# Altium schematic sheet Inversor.SchDoc
size A4
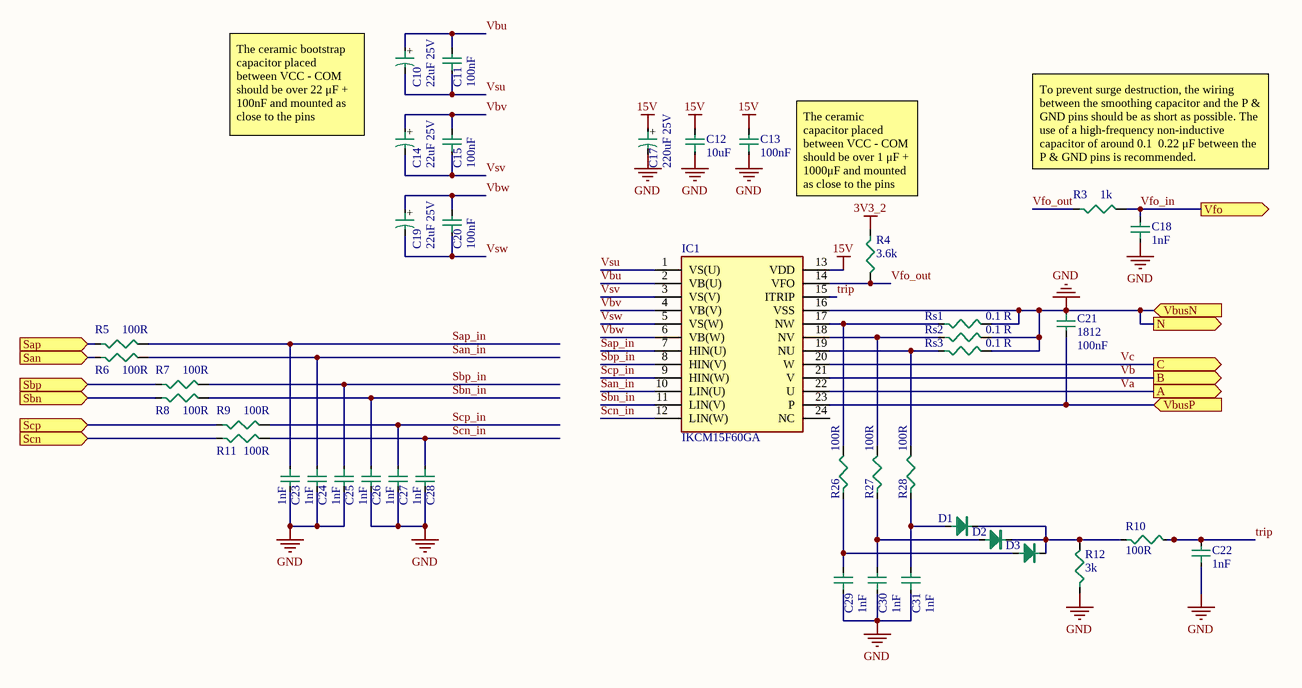
[diagram p0: Inversor.SchDoc]

## Parts
C10  value 22uF 25V  [CAP SMD D5.0 A5.4]  (hidden comment: D5.0 A5.4)
C11  value 100nF  [0805C]  (hidden comment: 0805)
C12  value 10uF  [0805C]  (hidden comment: 0805)
C13  value 100nF  [0805C]  (hidden comment: 0805)
C14  value 22uF 25V  [CAP SMD D5.0 A5.4]  (hidden comment: D5.0 A5.4)
C15  value 100nF  [0805C]  (hidden comment: 0805)
C17  value 220uF 25V  [CAP SMD D8.0 A10.2]  (hidden comment: D8.0 A10.2)
C18  value 1nF  [0805C]  (hidden comment: 0805)
C19  value 22uF 25V  [CAP SMD D5.0 A5.4]  (hidden comment: D5.0 A5.4)
C20  value 100nF  [0805C]  (hidden comment: 0805)
C21  1812  value 100nF  [1812C]
C22  value 1nF  [0805C]  (hidden comment: 0805)
C23  value 1nF  [0805C]  (hidden comment: 0805)
C24  value 1nF  [0805C]  (hidden comment: 0805)
C25  value 1nF  [0805C]  (hidden comment: 0805)
C26  value 1nF  [0805C]  (hidden comment: 0805)
C27  value 1nF  [0805C]  (hidden comment: 0805)
C28  value 1nF  [0805C]  (hidden comment: 0805)
C29  value 1nF  [0805C]  (hidden comment: 0805)
C30  value 1nF  [0805C]  (hidden comment: 0805)
C31  value 1nF  [0805C]  (hidden comment: 0805)
D1  1N4148 SMD  [DIODE SMD LL-34]  (value not drawn)
D2  1N4148 SMD  [DIODE SMD LL-34]  (value not drawn)
D3  1N4148 SMD  [DIODE SMD LL-34]  (value not drawn)
IC1  IKCM15F60GA  [INF-CIPOS MINI]
R3  value 1k  [0805]  (hidden comment: 0805)
R4  value 3.6k  [0805]  (hidden comment: 0805)
R5  value 100R  [0805]  (hidden comment: 0805)
R6  value 100R  [0805]  (hidden comment: 0805)
R7  value 100R  [0805]  (hidden comment: 0805)
R8  value 100R  [0805]  (hidden comment: 0805)
R9  value 100R  [0805]  (hidden comment: 0805)
R10  value 100R  [0805]  (hidden comment: 0805)
R11  value 100R  [0805]  (hidden comment: 0805)
R12  value 3k  [0805]  (hidden comment: 0805)
R26  value 100R  [0805]  (hidden comment: 0805)
R27  value 100R  [0805]  (hidden comment: 0805)
R28  value 100R  [0805]  (hidden comment: 0805)
Rs1  value 0.1 R  [CRA2512]  (hidden comment: Resistor shunt SMD 3 W)
Rs2  value 0.1 R  [CRA2512]  (hidden comment: Resistor shunt SMD 3 W)
Rs3  value 0.1 R  [CRA2512]  (hidden comment: Resistor shunt SMD 3 W)

## Ports
A (out), B (out), C (out), N (out), San (in), Sap (in), Sbn (in), Sbp (in), Scn (in), Scp (in), VbusN (in), VbusP (in), Vfo (out)

## Nets
3V3_2: R4.1
15V: C12.2 C13.2 C17.1 IC1.13(VDD)
GND: C12.1 C13.1 C17.2 C18.1 C21.1 C22.1 C23.2 C24.2 C25.2 C26.2 C27.2 C28.2 C29.1 C30.1 C31.1 IC1.16(VSS) R12.1 Rs1.2 Rs2.2 Rs3.2 ; port VbusN, port N
San: R6.1 ; port San
San_in: C24.1 IC1.10(LIN(U)) R6.2
Sap: R5.1 ; port Sap
Sap_in: C23.1 IC1.7(HIN(U)) R5.2
Sbn: R8.1 ; port Sbn
Sbn_in: C26.1 IC1.11(LIN(V)) R8.2
Sbp: R7.1 ; port Sbp
Sbp_in: C25.1 IC1.8(HIN(V)) R7.2
Scn: R11.1 ; port Scn
Scn_in: C28.1 IC1.12(LIN(W)) R11.2
Scp: R9.1 ; port Scp
Scp_in: C27.1 IC1.9(HIN(W)) R9.2
trip: C22.2 IC1.15(ITRIP) R10.2
Va: IC1.22(U) ; port A
Vb: IC1.21(V) ; port B
Vbu: C10.1 C11.2 IC1.2(VB(U))
VbusP: C21.2 IC1.23(P) ; port VbusP
Vbv: C14.1 C15.2 IC1.4(VB(V))
Vbw: C19.1 C20.2 IC1.6(VB(W))
Vc: IC1.20(W) ; port C
Vfo_in: C18.2 R3.2 ; port Vfo
Vfo_out: IC1.14(VFO) R3.1 R4.2
Vsu: C10.2 C11.1 IC1.1(VS(U))
Vsv: C14.2 C15.1 IC1.3(VS(V))
Vsw: C19.2 C20.1 IC1.5(VS(W))
NetC29_2: C29.2 D3.A R26.1
NetC30_2: C30.2 D2.A R27.1
NetC31_2: C31.2 D1.A R28.1
NetD1_K: D1.K D2.K D3.K R10.1 R12.2
NetIC1_17: IC1.17(NW) R26.2 Rs1.1
NetIC1_18: IC1.18(NV) R27.2 Rs2.1
NetIC1_19: IC1.19(NU) R28.2 Rs3.1

Not connected (* = marked no-connect by the designer): IC1 24(NC)

## Notes on the sheet
- The ceramic bootstrap capacitor placed between VCC - COM should be over 22 μF + 100nF and mounted as close to the pins
- The ceramic capacitor placed between VCC - COM should be over 1 μF + 1000μF and mounted as close to the pins
- To prevent surge destruction, the wiring between the smoothing capacitor and the P & GND pins should be as short as possible. The use of a high-frequency non-inductive
  capacitor of around 0.1  0.22 μF between the P & GND pins is recommended.
- (in symbol Capacitor SMD D5.0 A5.4) +
- (in symbol Capacitor SMD D8.0 A10.2) +

## Library data of the parts
C10 C14 C19 = Capacitor SMD D5.0 A5.4: %: ±20%
C11-C13 C15 C18 C20 C22-C31 = Capacitor SMD 0805
C17 = Capacitor SMD D8.0 A10.2: %: ±20%
C21 = Capacitor SMD 1812
D1-D3 = Diodo Sinal SMD 1N4148: Diodo Sinal SMD LL-34
IC1 = IKCM15F60GA: Integrated Circuit; Manufacturer_Name: Infineon; Datasheet Link: https://www.infineon.com/dgdl/Infineon-IKCM15F60GA-DS-v02_05-EN.pdf?fileId=5546d4624fb7fef2014fcb43b29e78c1; Manufacturer_Part_Number: IKCM15F60GA; Mouser Part Number: 641-IKCM15F60GA; Mouser Price/Stock: https://www.mouser.co.uk/ProductDetail/Infineon-Technologies/IKCM15F60GA?qs=ZhYpuuF1jLgW0cweeAu4yg%3D%3D
R3-R12 R26-R28 = Resistor SMD 0805 1/8 W: %: ±1%; P: 1/8W
Rs1-Rs3 = Resistor shunt SMD 3 W: Resistor SMD 0805 1/8 W; %: ±1%; P: 3W